# EAGLE design sim-breakout (EAGLE 6.1)
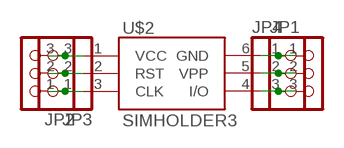
[diagram p0: schematic, sheet 1]

## Parts
JP1  PINHD-1X3  [1X03]
JP2  PINHD-1X3  [1X03]
JP3  PINHD-1X3  [1X03]
JP4  PINHD-1X3  [1X03]
U$2  SIMHOLDER3  [SIMHOLDER3]

## Nets
N$1: JP1.1 JP4.1 U$2.6(GND)
N$2: JP1.2 JP4.2 U$2.5(VPP)
N$3: JP1.3 JP4.3 U$2.4(I/O)
N$4: JP2.1 JP3.1 U$2.3(CLK)
N$5: JP2.2 JP3.2 U$2.2(RST)
N$6: JP2.3 JP3.3 U$2.1(VCC)

## Library data of the parts
JP1-JP4 = pinhead:PINHD-1X3: PIN HEADER
U$2 = SparkFun-Connectors:SIMHOLDER3: Alternate SIM card socket

## Board
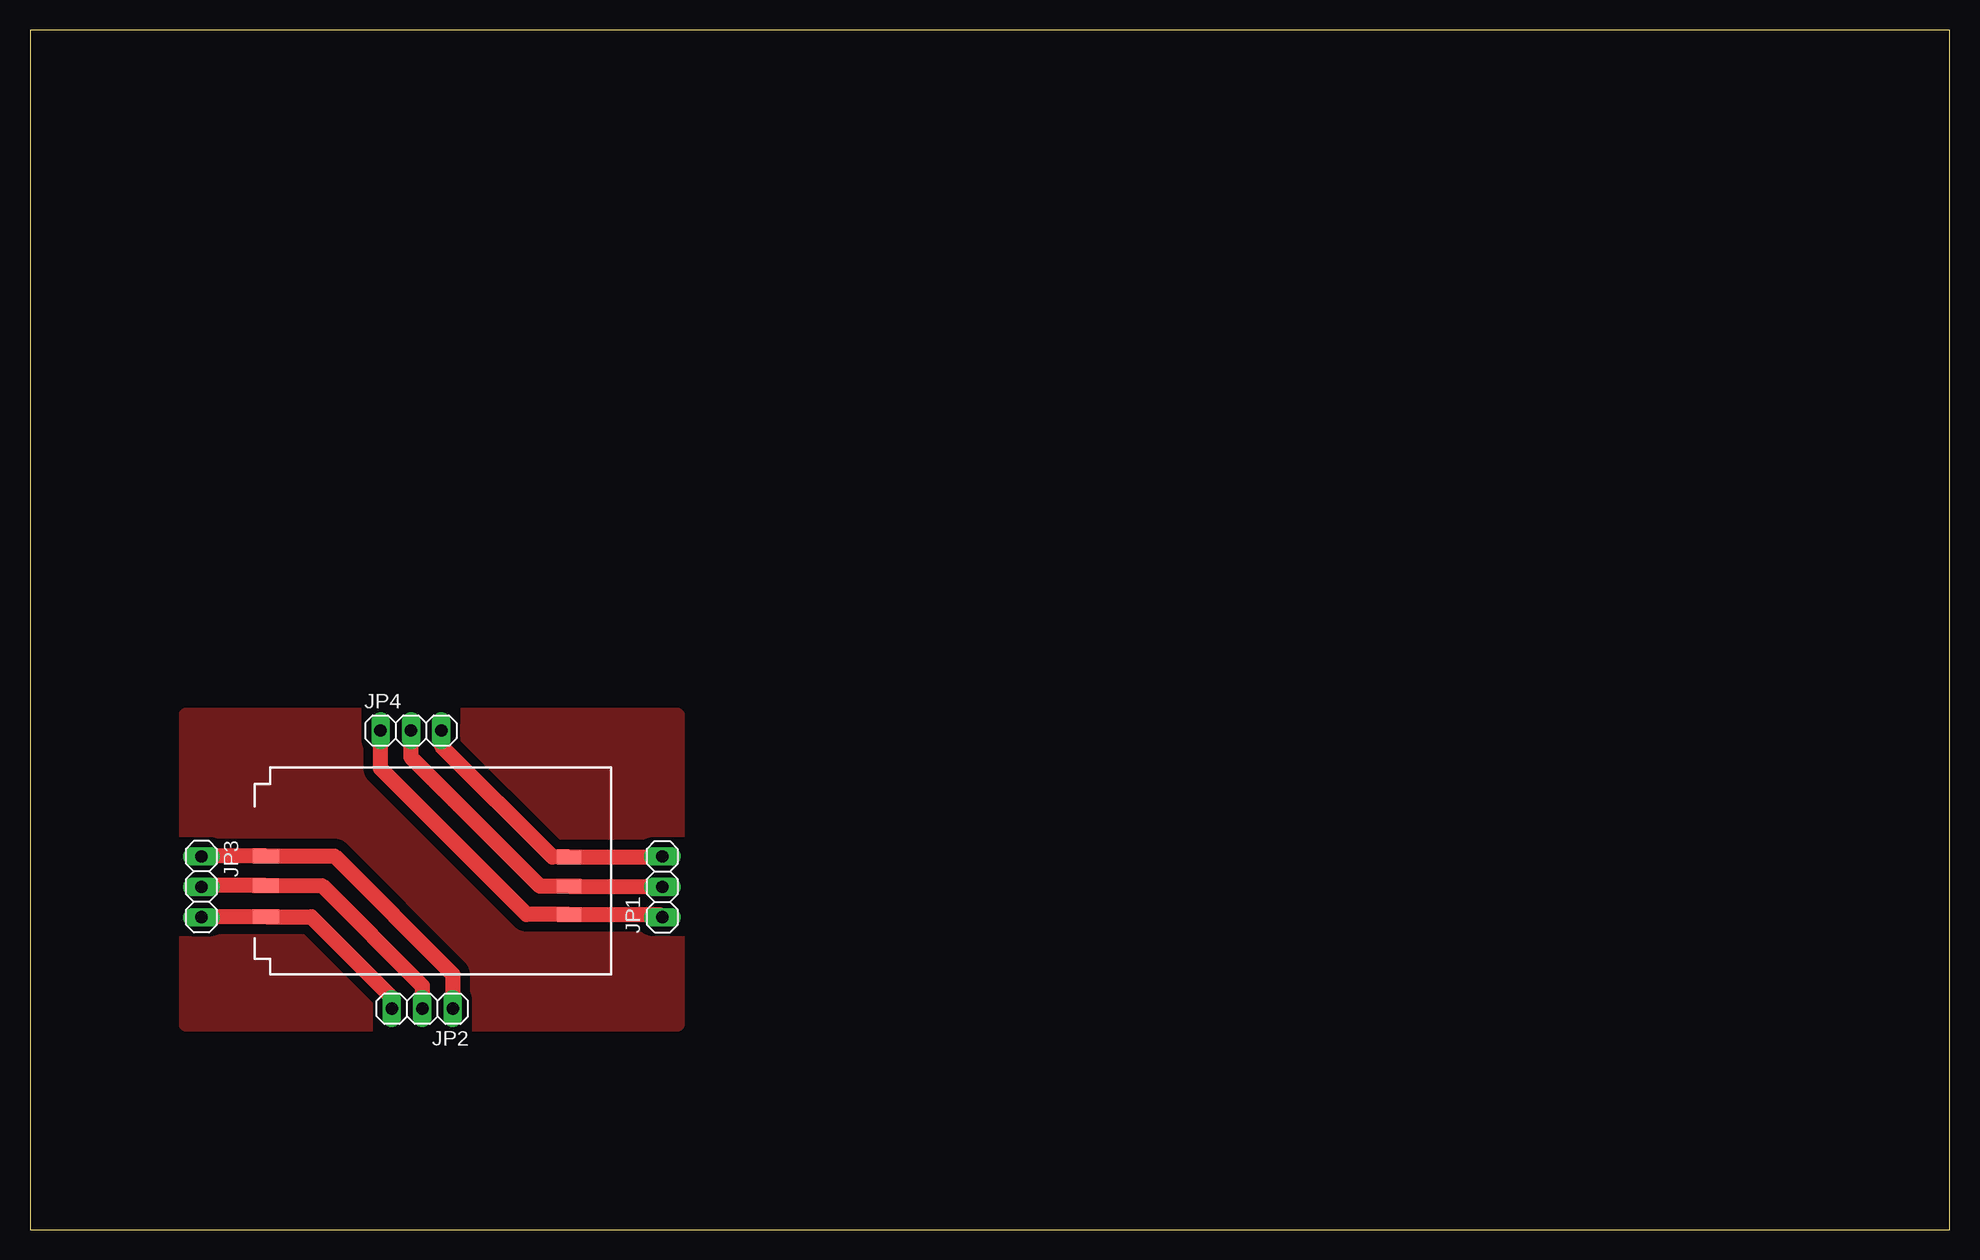
[diagram p1: board, top side]
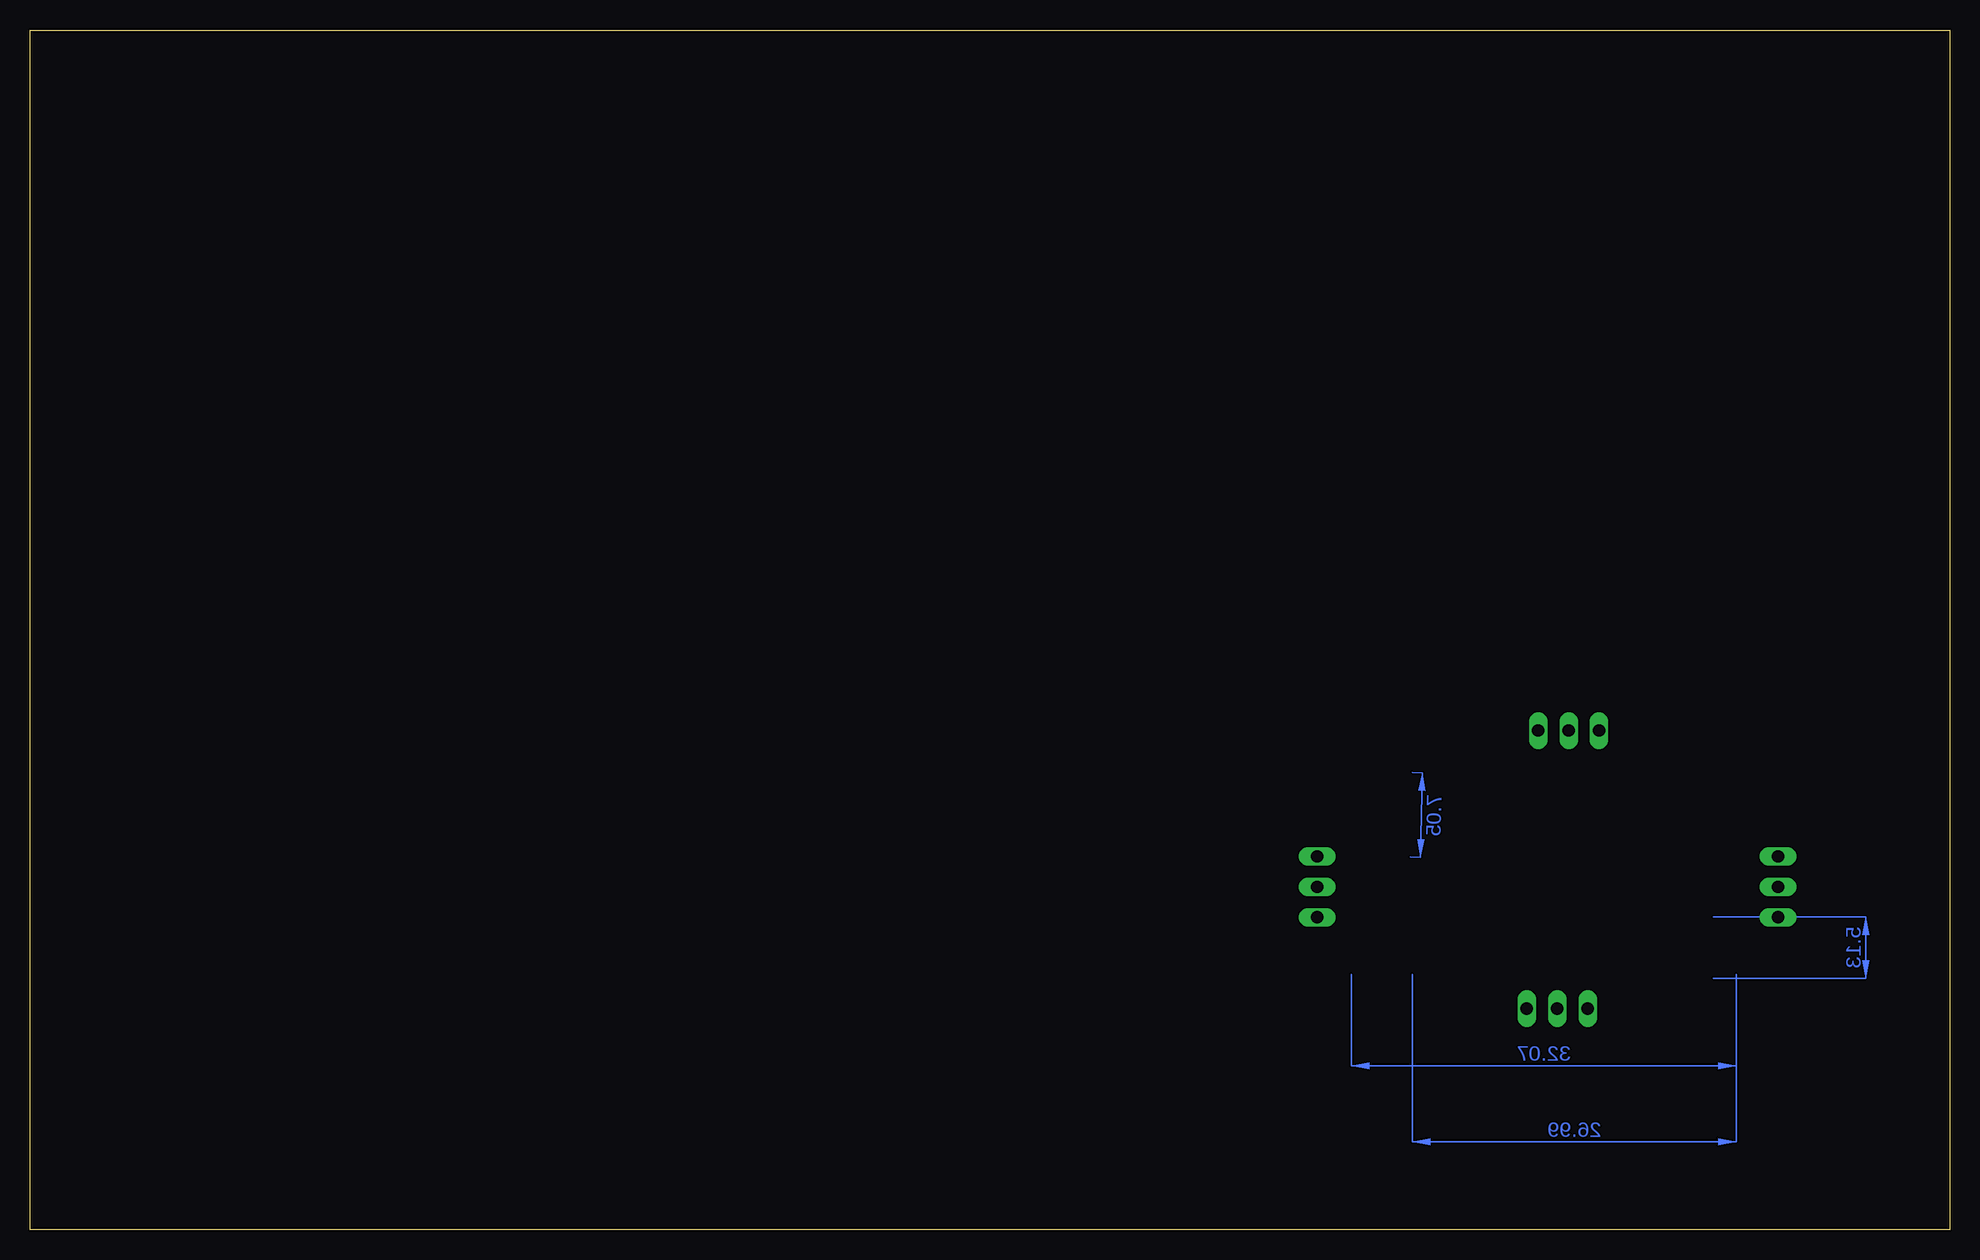
[diagram p2: board, bottom side, seen from below]

Size 160 x 100 mm. Coordinates in mm from the lower left corner, seen from the top.
Outline: 0,0 160,0 160,100 0,100 0,0
Copper layers (1*16): Top 0.035mm / dielectric 1.5mm / Bottom 0.035mm
Design rules: minimum track width 10mil, minimum drill 24mil, track to track 8mil, track to pad 8mil, pad to pad 8mil, via to via 8mil, smd to smd 8mil, copper to edge 40mil, drill to drill 8mil, minimum pad ring 10mil, minimum via ring 8mil, stop-mask expansion 4mil, vias tented up to drill 0mil, thermal gap 10mil

### Footprints (pad centres in the part's own frame; a part is rotated, then mirrored left to right if it is on the bottom)
1X03 = drill 1.016 long: 1 -2.54,0; 2 0,0; 3 2.54,0
SIMHOLDER3 = smd 2.2 x 1.2: 1 0.95,4.81; 2 0.91,7.41; 3 0.95,9.86 | smd 2 x 1.2: 4 26.2,9.78; 5 26.22,7.34; 6 26.22,4.98

### Placement (x,y rotation side)
JP1  52.7,28.57 90 top
JP2  32.7,18.41 180 top
JP3  14.29,28.57 270 top
JP4  31.75,41.59 0 top
U$2  18.73,21.27 0 top

### Tracks (layer width: path | path; a pad name or v marks a point on that pad's centre or on a via)
N$1
  Top 1.27: JP4.1 29.21,38.42 41.38,26.25 U$2.6 52.49,26.25 JP1.1
N$2
  Top 1.27: JP4.2 31.75,39.37 42.51,28.61 U$2.5 52.67,28.61 JP1.2
N$3
  Top 1.27: JP4.3 34.29,40.32 43.56,31.05 U$2.4 52.64,31.05 JP1.3
N$4
  Top 1.27: JP3.1 14.3,31.13 U$2.3 25.38,31.13 35.24,21.27 JP2.1
N$5
  Top 1.27: JP3.2 14.39,28.68 U$2.2 24.34,28.68 32.7,20.32 JP2.2
N$6
  Top 1.27: JP3.3 14.34,26.08 U$2.1 23.45,26.08 30.16,19.37 JP2.3
N$7
  pour Top (isolate 0.813, no thermals): 13.02,17.14 53.98,17.14 53.98,42.86 13.02,42.86
(copper drawn outside any net)
  shapes: Bottom area x4